# EAGLE design RC TOOLBOX (EAGLE 9.7.0)

## Sheet 1 of 3
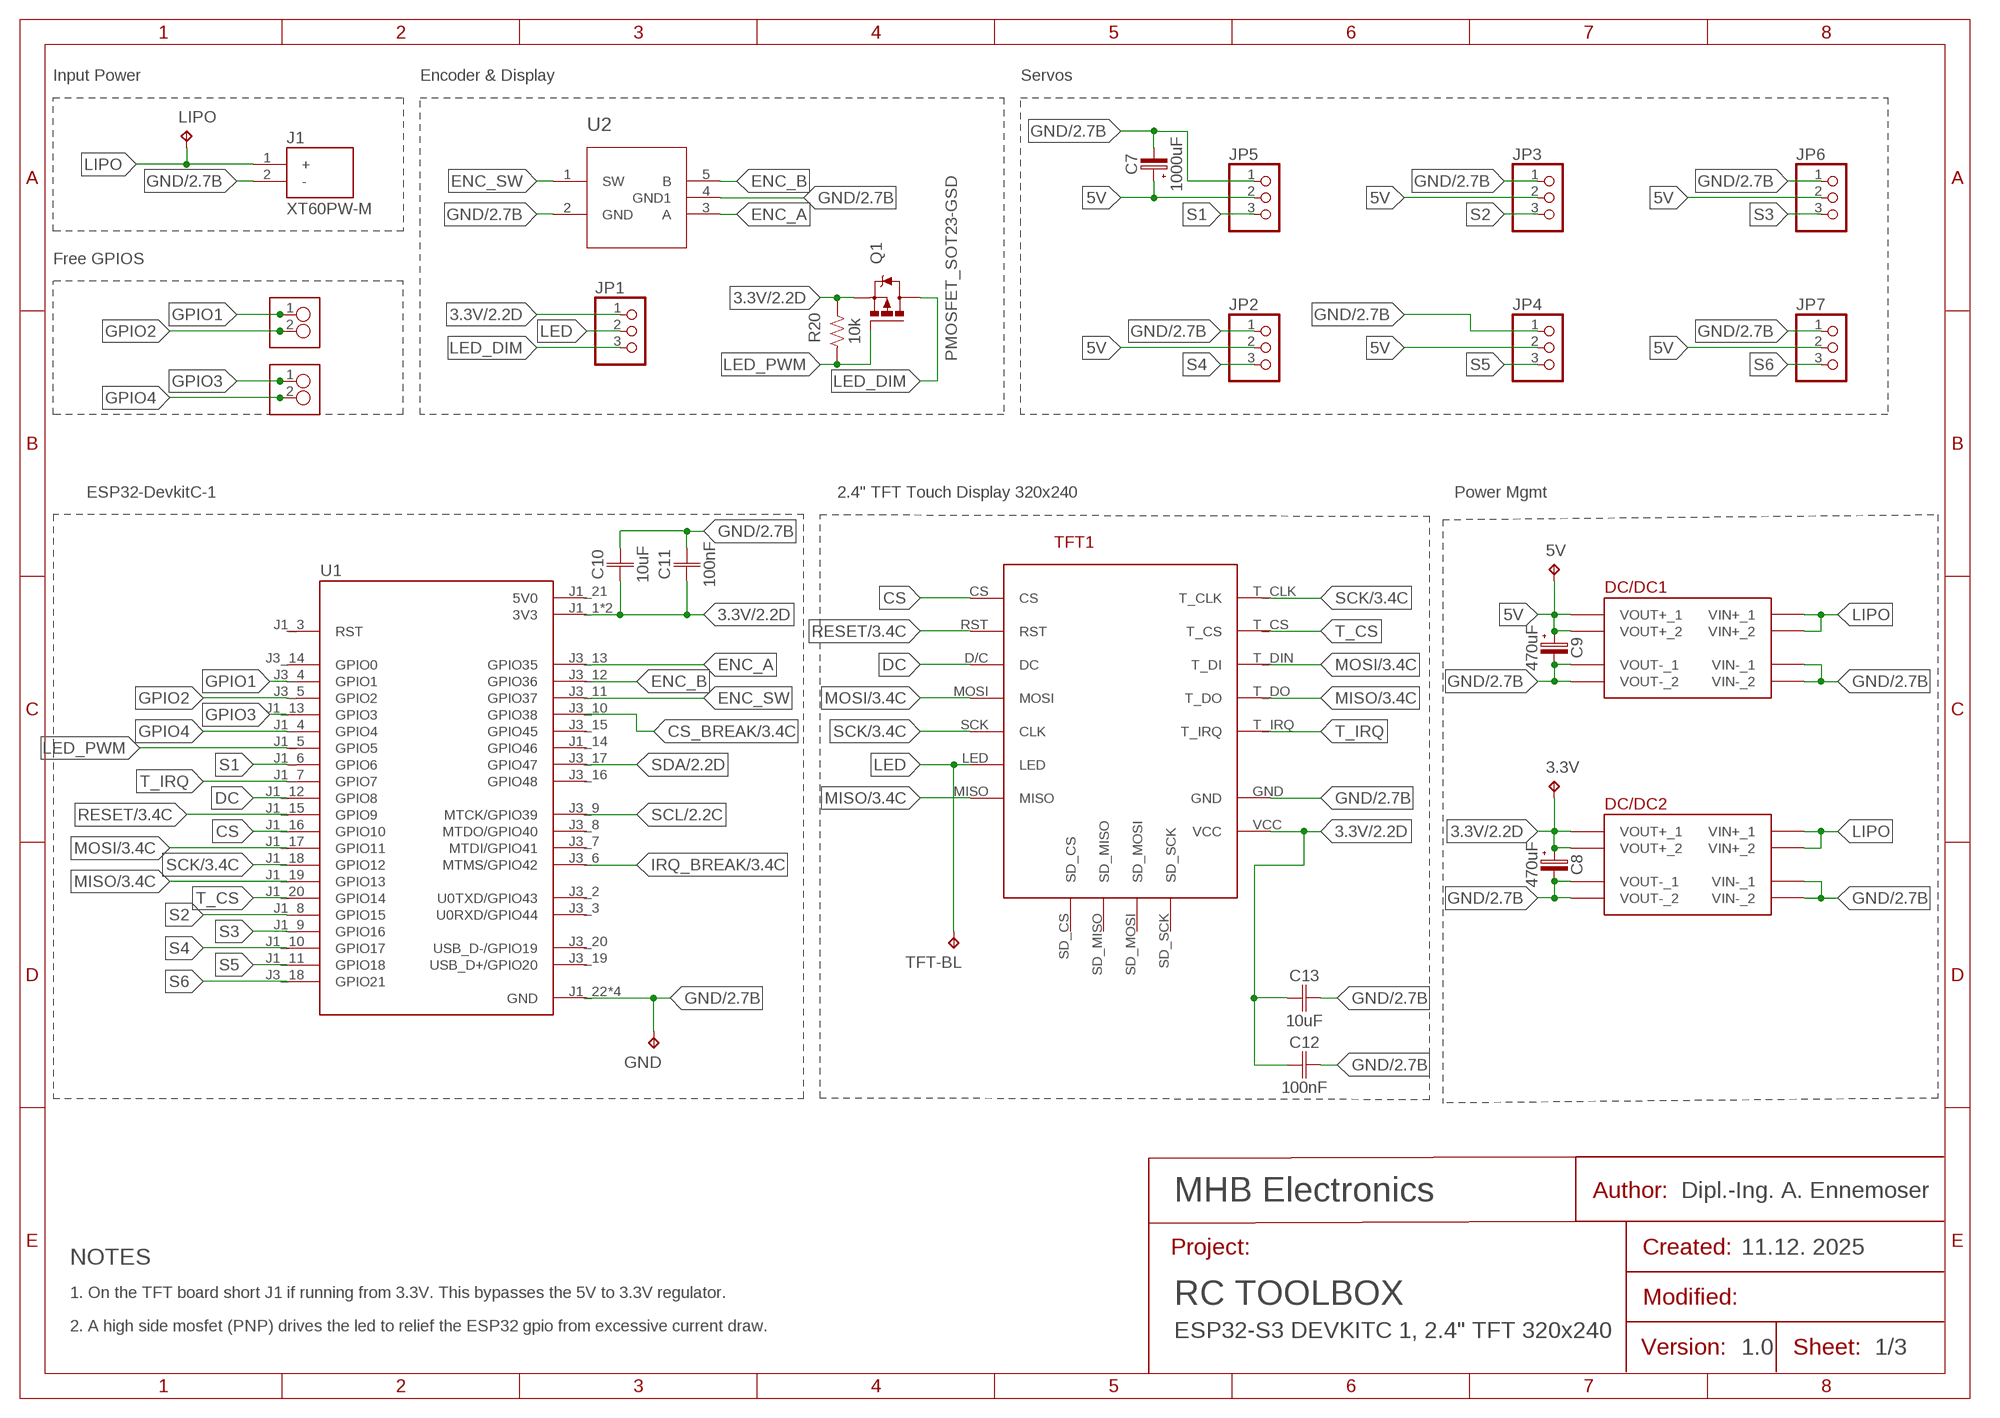
[diagram p0: schematic, sheet 1]
U$1 (FRAME_AE_A4L): AUTHOR1: Dipl.-Ing. A. Ennemoser; COMPANY: MHB Electronics; CREATED: 11.12. 2025; TITLE_1: RC TOOLBOX; TITLE_2: ESP32-S3 DEVKITC 1, 2.4" TFT 320x240; VERSION: 1.0

### Parts
3.3V  TPB1,27  [B1,27]
5V  TPB1,27  [B1,27]
C7  1000uF  C-POL_ECAP-8.5MM  [CAPAE830X1050N]
C8  470uF  C-POL_ECAP-8.5MM  [CAPAE830X1050N]
C9  470uF  C-POL_ECAP-8.5MM  [CAPAE830X1050N]
C10  10uF  C_CHIP-1206(3216-METRIC)  [CAPC3216X135]
C11  100nF  C_CHIP-1206(3216-METRIC)  [CAPC3216X135]
C12  100nF  C_CHIP-1206(3216-METRIC)  [CAPC3216X135]
C13  10uF  C_CHIP-1206(3216-METRIC)  [CAPC3216X135]
DC/DC1  DC/DC_4.5-28VIN_0.8-20VOUTDC/DC_4.5-28VIN_0.8-20VOUT  [DC/DC_4.5-28VIN_0.8-20VOUT]
DC/DC2  DC/DC_4.5-28VIN_0.8-20VOUTDC/DC_4.5-28VIN_0.8-20VOUT  [DC/DC_4.5-28VIN_0.8-20VOUT]
GND  TPB1,27  [B1,27]
J1  XT60PW-M  [AMASS_XT60PW-M]
JP1  PINHD-1X3  [1X03]
JP2  PINHD-1X3  [1X03]
JP3  PINHD-1X3  [1X03]
JP4  PINHD-1X3  [1X03]
JP5  PINHD-1X3  [1X03]
JP6  PINHD-1X3  [1X03]
JP7  PINHD-1X3  [1X03]
JP8  PINHD_1X2PINHD_1X2  [PINHD_1X2]
JP10  PINHD_1X2PINHD_1X2  [PINHD_1X2]
LIPO  TPB1,27  [B1,27]
Q1  PMOSFET_SOT23-GSD  [SOT23]
R20  10k  R-US_CHIP-1206(3216-METRIC)  [RESC3216X70]
TFT1  2.4" 320x240 ILI9341/XPT2046 Touch Display  TFT_TOUCH_ILI9341  [TFT_TOUCH_ILI9341_2.4_INCH]
TFT-BL  TPB1,27  [B1,27]
U1  ESP32-S3-DEVKITC-1-N8R2  [XCVR_ESP32-S3-DEVKITC-1-N8R2]
U2  EC11-360EC11-360  [EC11-360]

### Nets
3.3V: 3.3V.TP C8.1(+) C10.1 C11.1 C12.1 C13.1 DC/DC2.VOUT+_1 DC/DC2.VOUT+_2 JP1.1 Q1.2(S) R20.2 TFT1.VCC U1.J1_1(3V3) U1.J1_2(3V3) ; also sheet 2,3
5V: 5V.TP C7.1(+) C9.1(+) DC/DC1.VOUT+_1 DC/DC1.VOUT+_2 JP2.2 JP3.2 JP4.2 JP5.2 JP6.2 JP7.2
CS: TFT1.CS U1.J1_16(GPIO10)
CS_BREAK: U1.J3_10(GPIO38) ; also sheet 3
DC: TFT1.D/C(DC) U1.J1_12(GPIO8)
ENC_A: U1.J3_13(GPIO35) U2.3(A)
ENC_B: U1.J3_12(GPIO36) U2.5(B)
ENC_SW: U1.J3_11(GPIO37) U2.1(SW)
GND: C7.2(-) C8.2(-) C9.2(-) C10.2 C11.2 C12.2 C13.2 DC/DC1.VIN-_1 DC/DC1.VIN-_2 DC/DC1.VOUT-_1 DC/DC1.VOUT-_2 DC/DC2.VIN-_1 DC/DC2.VIN-_2 DC/DC2.VOUT-_1 DC/DC2.VOUT-_2 GND.TP J1.2(-) JP2.1 JP3.1 JP4.1 JP5.1 JP6.1 JP7.1 TFT1.GND U1.J1_22(GND) U1.J3_1(GND) U1.J3_21(GND) U1.J3_22(GND) U2.2(GND) U2.4(GND1) ; also sheet 2,3
GPIO1: JP10.1 U1.J3_4(GPIO1)
GPIO2: JP10.2 U1.J3_5(GPIO2)
GPIO3: JP8.1 U1.J1_13(GPIO3)
GPIO4: JP8.2 U1.J1_4(GPIO4)
IRQ_BREAK: U1.J3_6(MTMS/GPIO42) ; also sheet 3
LED: JP1.2 TFT1.LED TFT-BL.TP
LED_DIM: JP1.3 Q1.3(D)
LED_PWM: Q1.1(G) R20.1 U1.J1_5(GPIO5)
LIPO: DC/DC1.VIN+_1 DC/DC1.VIN+_2 DC/DC2.VIN+_1 DC/DC2.VIN+_2 J1.1(+) LIPO.TP
MISO: TFT1.MISO TFT1.T_DO U1.J1_19(GPIO13) ; also sheet 3
MOSI: TFT1.MOSI TFT1.T_DIN(T_DI) U1.J1_17(GPIO11) ; also sheet 3
RESET: TFT1.RST U1.J1_15(GPIO9) ; also sheet 3
S1: JP5.3 U1.J1_6(GPIO6)
S2: JP3.3 U1.J1_8(GPIO15)
S3: JP6.3 U1.J1_9(GPIO16)
S4: JP2.3 U1.J1_10(GPIO17)
S5: JP4.3 U1.J1_11(GPIO18)
S6: JP7.3 U1.J3_18(GPIO21)
SCK: TFT1.SCK(CLK) TFT1.T_CLK U1.J1_18(GPIO12) ; also sheet 3
SCL: U1.J3_9(MTCK/GPIO39) ; also sheet 2,3
SDA: U1.J3_17(GPIO47) ; also sheet 2,3
T_CS: TFT1.T_CS U1.J1_20(GPIO14)
T_IRQ: TFT1.T_IRQ U1.J1_7(GPIO7)
Unconnected: TFT1.SD_CS TFT1.SD_MISO TFT1.SD_MOSI TFT1.SD_SCK U1.J1_3(RST) U1.J1_14(GPIO46) U1.J3_2(U0TXD/GPIO43) U1.J3_3(U0RXD/GPIO44) U1.J3_7(MTDI/GPIO41) U1.J3_8(MTDO/GPIO40) U1.J3_14(GPIO0) U1.J3_15(GPIO45) U1.J3_16(GPIO48) U1.J3_19(USB_D+/GPIO20) U1.J3_20(USB_D-/GPIO19)

### Notes on the sheet
- Input Power | Encoder & Display | Servos
- Free GPIOS
- ESP32-DevkitC-1 | 2.4" TFT Touch Display 320x240 | Power Mgmt
- NOTES
- 1. On the TFT board short J1 if running from 3.3V. This bypasses the 5V to 3.3V regulator.
- 2. A high side mosfet (PNP) drives the led to relief the ESP32 gpio from excessive current draw.

## Sheet 2 of 3
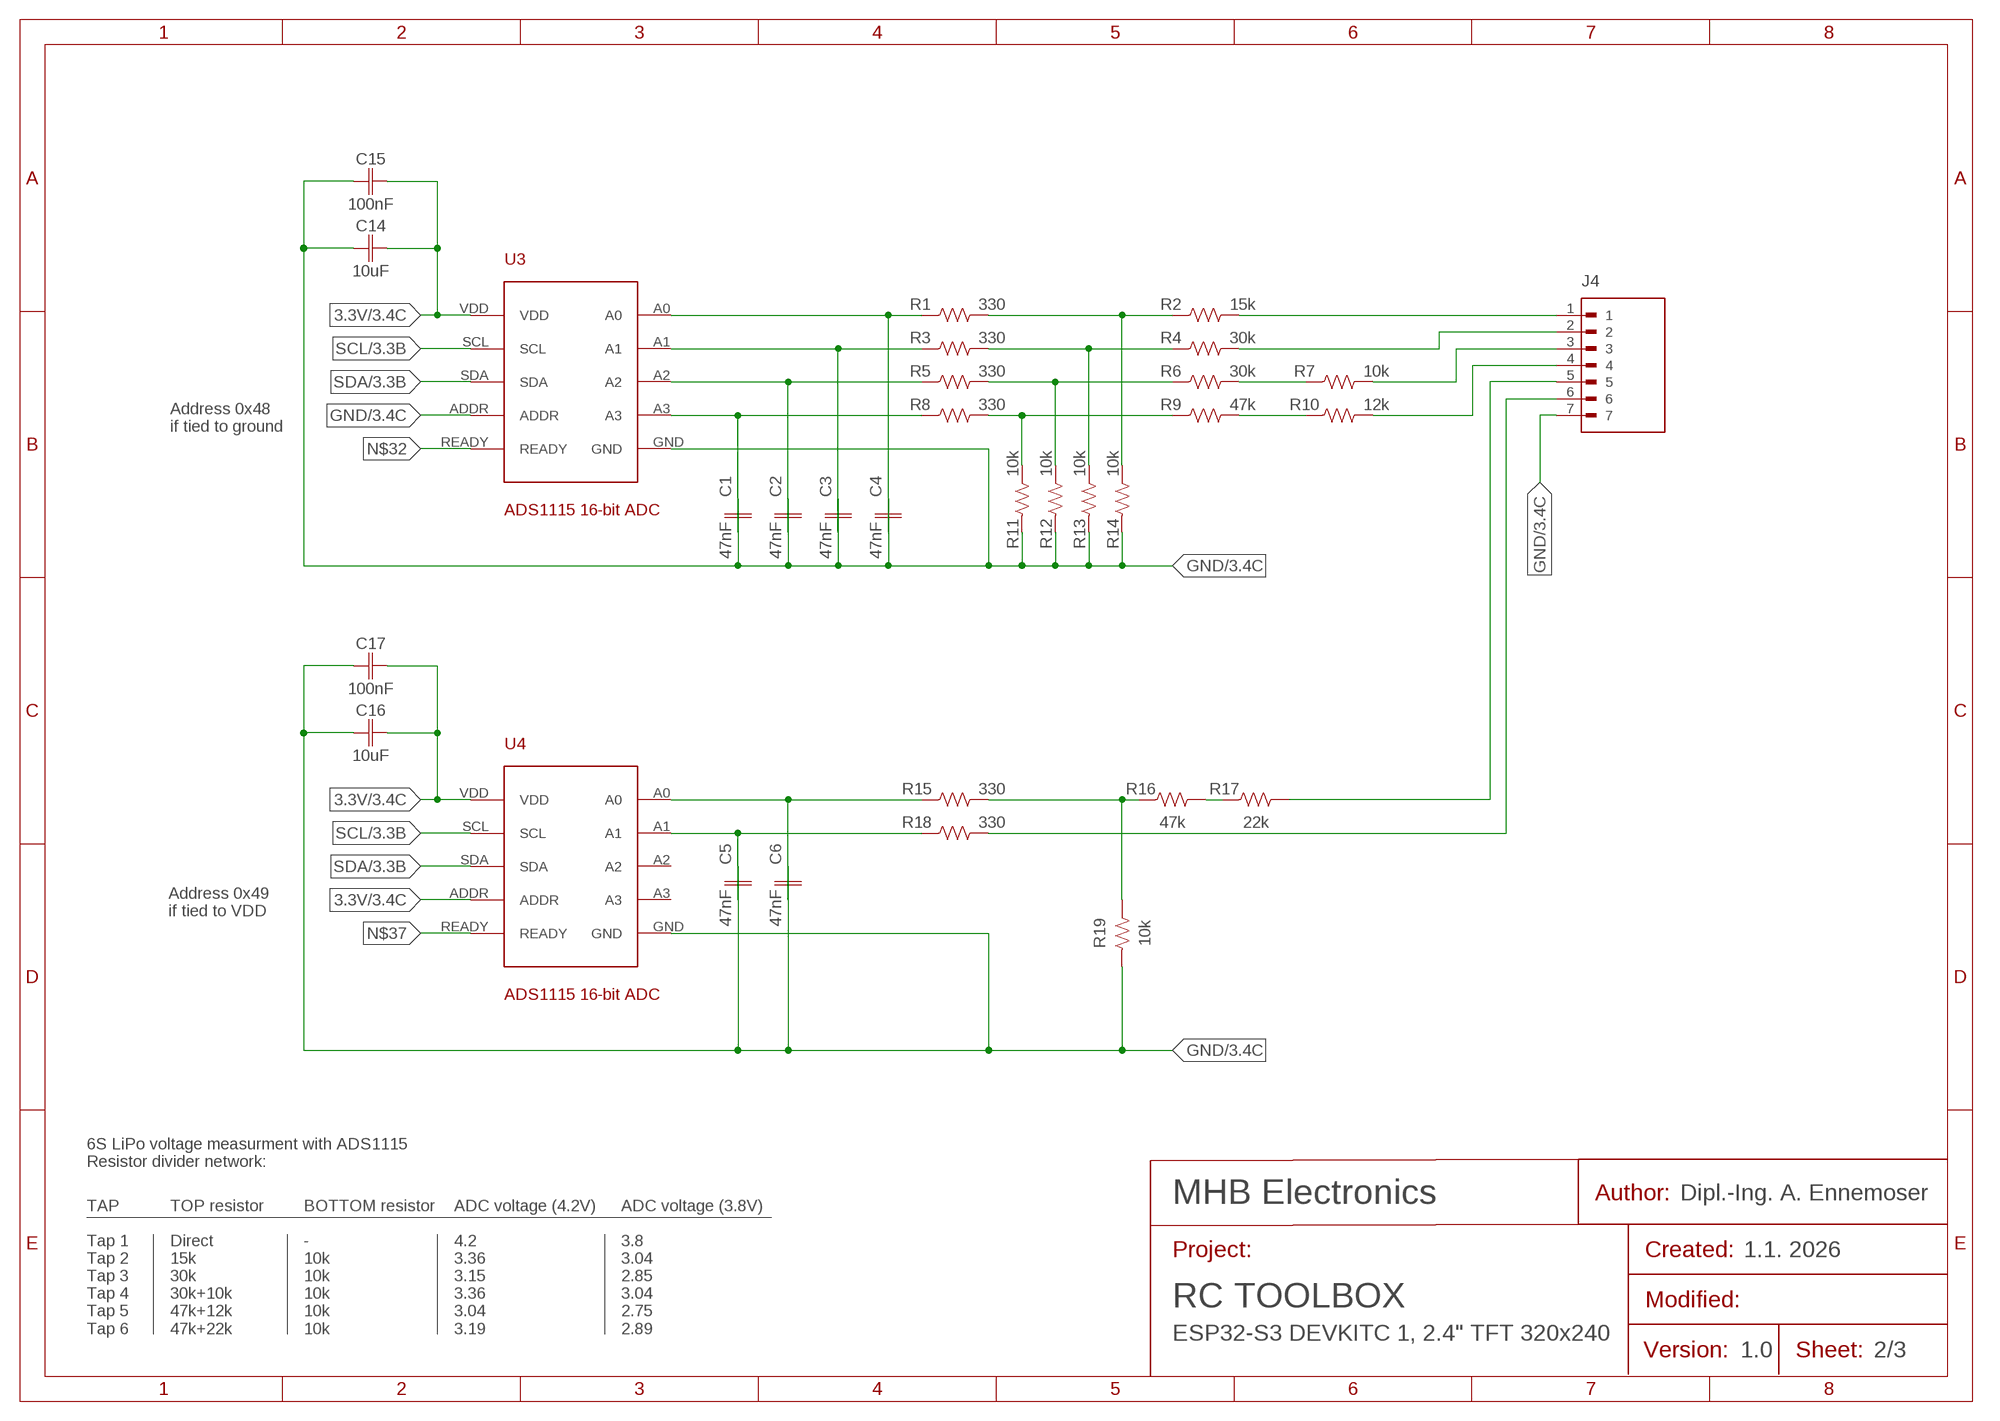
[diagram p1: schematic, sheet 2]
U$2 (FRAME_AE_A4L): AUTHOR1: Dipl.-Ing. A. Ennemoser; COMPANY: MHB Electronics; CREATED: 1.1. 2026; TITLE_1: RC TOOLBOX; TITLE_2: ESP32-S3 DEVKITC 1, 2.4" TFT 320x240; VERSION: 1.0

### Parts
C1  47nF  C_CHIP-1206(3216-METRIC)  [CAPC3216X135]
C2  47nF  C_CHIP-1206(3216-METRIC)  [CAPC3216X135]
C3  47nF  C_CHIP-1206(3216-METRIC)  [CAPC3216X135]
C4  47nF  C_CHIP-1206(3216-METRIC)  [CAPC3216X135]
C5  47nF  C_CHIP-1206(3216-METRIC)  [CAPC3216X135]
C6  47nF  C_CHIP-1206(3216-METRIC)  [CAPC3216X135]
C14  10uF  C_CHIP-1206(3216-METRIC)  [CAPC3216X135]
C15  100nF  C_CHIP-1206(3216-METRIC)  [CAPC3216X135]
C16  10uF  C_CHIP-1206(3216-METRIC)  [CAPC3216X135]
C17  100nF  C_CHIP-1206(3216-METRIC)  [CAPC3216X135]
J4  S7B-XH-AS7B-XH-A  [S7B-XH-A]
R1  330  R-US_CHIP-1206(3216-METRIC)  [RESC3216X70]
R2  15k  R-US_CHIP-1206(3216-METRIC)  [RESC3216X70]
R3  330  R-US_CHIP-1206(3216-METRIC)  [RESC3216X70]
R4  30k  R-US_CHIP-1206(3216-METRIC)  [RESC3216X70]
R5  330  R-US_CHIP-1206(3216-METRIC)  [RESC3216X70]
R6  30k  R-US_CHIP-1206(3216-METRIC)  [RESC3216X70]
R7  10k  R-US_CHIP-1206(3216-METRIC)  [RESC3216X70]
R8  330  R-US_CHIP-1206(3216-METRIC)  [RESC3216X70]
R9  47k  R-US_CHIP-1206(3216-METRIC)  [RESC3216X70]
R10  12k  R-US_CHIP-1206(3216-METRIC)  [RESC3216X70]
R11  10k  R-US_CHIP-1206(3216-METRIC)  [RESC3216X70]
R12  10k  R-US_CHIP-1206(3216-METRIC)  [RESC3216X70]
R13  10k  R-US_CHIP-1206(3216-METRIC)  [RESC3216X70]
R14  10k  R-US_CHIP-1206(3216-METRIC)  [RESC3216X70]
R15  330  R-US_CHIP-1206(3216-METRIC)  [RESC3216X70]
R16  47k  R-US_CHIP-1206(3216-METRIC)  [RESC3216X70]
R17  22k  R-US_CHIP-1206(3216-METRIC)  [RESC3216X70]
R18  330  R-US_CHIP-1206(3216-METRIC)  [RESC3216X70]
R19  10k  R-US_CHIP-1206(3216-METRIC)  [RESC3216X70]
U3  ADS1115 16-bit ADC  ADS1115ADS1115_BREAKOUT  [ADS1115_BREAKOUT]
U4  ADS1115 16-bit ADC  ADS1115ADS1115_BREAKOUT  [ADS1115_BREAKOUT]

### Nets
3.3V: C14.2 C15.2 C16.2 C17.2 U3.VDD U4.ADDR U4.VDD ; also sheet 1,3
GND: C1.2 C2.2 C3.2 C4.2 C5.2 C6.2 C14.1 C15.1 C16.1 C17.1 J4.7 R11.1 R12.1 R13.1 R14.1 R19.1 U3.ADDR U3.GND U4.GND ; also sheet 1,3
N$3: J4.6 R18.2
N$4: R16.2 R17.1
N$5: R6.2 R7.1
N$6: R9.2 R10.1
N$10: C1.1 R8.1 U3.A3
N$11: J4.5 R17.2
N$13: C4.1 R1.1 U3.A0
N$14: R15.2 R16.1 R19.2
N$15: R1.2 R2.1 R14.2
N$17: C3.1 R3.1 U3.A1
N$18: C2.1 R5.1 U3.A2
N$19: C5.1 R18.1 U4.A1
N$20: C6.1 R15.1 U4.A0
N$22: R8.2 R9.1 R11.2
N$23: J4.1 R2.2
N$24: R3.2 R4.1 R13.2
N$25: R5.2 R6.1 R12.2
N$26: J4.3 R7.2
N$27: J4.4 R10.2
N$30: J4.2 R4.2
N$32: U3.READY
N$37: U4.READY
SCL: U3.SCL U4.SCL ; also sheet 1,3
SDA: U3.SDA U4.SDA ; also sheet 1,3
Unconnected: U4.A2 U4.A3

### Notes on the sheet
- Address 0x48
  if tied to ground
- Address 0x49
  if tied to VDD
- 6S LiPo voltage measurment with ADS1115
  Resistor divider network:
- TAP
  
  Tap 1
  Tap 2
  Tap 3
  Tap 4
  Tap 5
  Tap 6
- TOP resistor
  
  Direct
  15k
  30k
  30k+10k
  47k+12k
  47k+22k
- BOTTOM resistor
  
  -
  10k
  10k
  10k
  10k
  10k
- ADC voltage (4.2V)
  
  4.2
  3.36
  3.15
  3.36
  3.04
  3.19
- ADC voltage (3.8V)
  
  3.8
  3.04
  2.85
  3.04
  2.75
  2.89

## Sheet 3 of 3
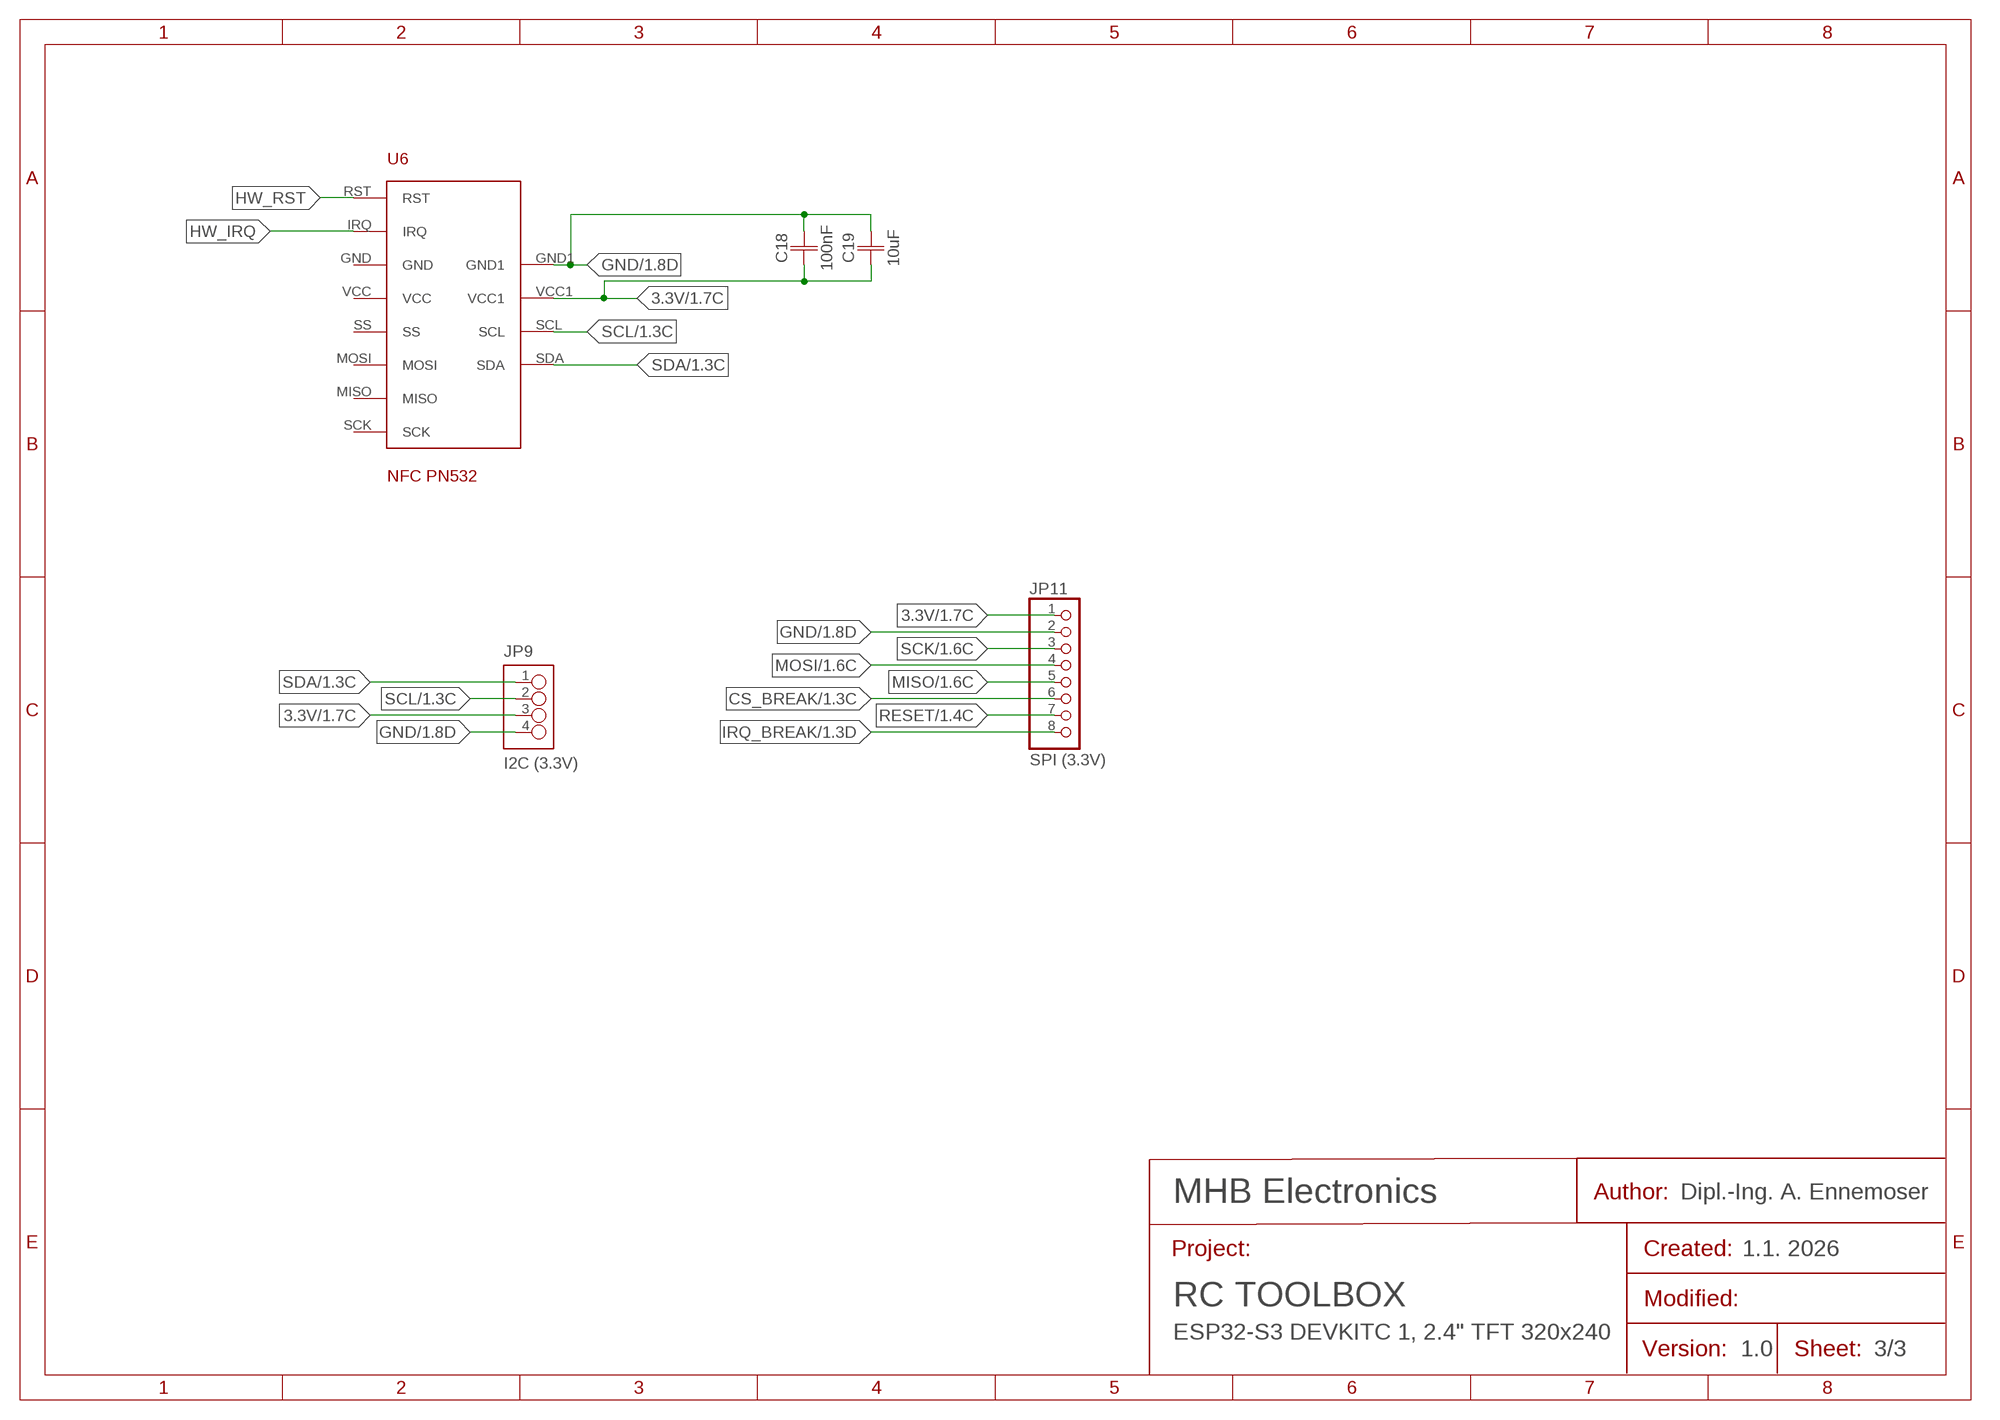
[diagram p2: schematic, sheet 3]
U$5 (FRAME_AE_A4L): AUTHOR1: Dipl.-Ing. A. Ennemoser; COMPANY: MHB Electronics; CREATED: 1.1. 2026; TITLE_1: RC TOOLBOX; TITLE_2: ESP32-S3 DEVKITC 1, 2.4" TFT 320x240; VERSION: 1.0

### Parts
C18  100nF  C_CHIP-1206(3216-METRIC)  [CAPC3216X135]
C19  10uF  C_CHIP-1206(3216-METRIC)  [CAPC3216X135]
JP9  I2C (3.3V)  PINHD_1X4PINHD_1X4  [PINHD_1X4]
JP11  SPI (3.3V)  PINHD-1X8CLEANBIG  [1X08-CLEANBIG]
U6  NFC PN532  NFC-PN532HW-147C-PN532  [NFC-PN532]

### Nets
3.3V: C18.1 C19.1 JP9.3 JP11.1 U6.VCC1 ; also sheet 1,2
CS_BREAK: JP11.6 ; also sheet 1
GND: C18.2 C19.2 JP9.4 JP11.2 U6.GND1 ; also sheet 1,2
HW_IRQ: U6.IRQ
HW_RST: U6.RST
IRQ_BREAK: JP11.8 ; also sheet 1
MISO: JP11.5 ; also sheet 1
MOSI: JP11.4 ; also sheet 1
RESET: JP11.7 ; also sheet 1
SCK: JP11.3 ; also sheet 1
SCL: JP9.2 U6.SCL ; also sheet 1,2
SDA: JP9.1 U6.SDA ; also sheet 1,2
Unconnected: U6.GND U6.MISO U6.MOSI U6.SCK U6.SS U6.VCC

## Power pins joined to a net without a drawn wire
5V0: U1.J1_21(5V0)

## Library data of the parts
3.3V 5V GND LIPO TFT-BL = testpad:TP: Test pad
C1-C6 C10-C19 = Capacitor:C: Capacitor - Generic; CATEGORY: Capacitor; PACKAGE_SIZE: 1206; PACKAGE_TYPE: Surface Mount; SUBCATEGORY: Ceramic Capacitors; TYPE: MLCC
C7-C9 = Capacitor:C-POL: Capacitor Polarised - Generic; CATEGORY: Capacitor; PACKAGE_SIZE: 8.5MM; PACKAGE_TYPE: Surface Mount; SUBCATEGORY: Aluminum Electrolytic Capacitors; TYPE: Radial Can
DC/DC1 DC/DC2 = Bibliothek:DC/DC_4.5-28VIN_0.8-20VOUT
J1 = AE_EAGLE_LIBRARY_FUSION:XT60PW-M: XT60PW-M AMASS PCB mountable XT60 connector; AVAILABILITY: Not in stock; CHECK_PRICES: https://www.snapeda.com/parts/XT60PW-M/AMASS/view-part/?ref=eda; DESCRIPTION: Socket, DC supply, male, PIN: 2; MF: AMASS; MP: XT60PW-M; PACKAGE: Package; PRICE: None; SNAPEDA_LINK: https://www.snapeda.com/parts/XT60PW-M/AMASS/view-part/?ref=snap
J4 = JST_SxB-XH-A:S7B-XH-A: Check availability <https://pricing.snapeda.com/parts/S9B-XH-A%28LF%29%28SN%29/JST%20Sales%20America%20Inc./view-part?ref=eda>
JP1-JP7 = adafruit:PINHD-1X3: PIN HEADER
JP8 JP10 = PINHD_AE:PINHD_1X2
JP9 = PINHD_AE:PINHD_1X4
JP11 = adafruit:PINHD-1X8: PIN HEADER
Q1 = Transistor:PMOSFET: P-Channel MOSFET - Generic; CATEGORY: Transistor; DATASHEET: https://www.analog.com/media/en/package-pcb-resources/package/pkg_pdf/ltc-legacy-sot-23/sot3%2005-08-1631%20rev%20d.pdf; DESCRIPTION: Generic P-Channel MOSFET Surface Mount SOT23 Package; PACKAGE_SIZE: SOT23; PACKAGE_TYPE: Surface Mount; SUBCATEGORY: MOSFET; TYPE: P-Channel
R1-R20 = Resistor:R-US: Resistor Fixed - ANSI; CATEGORY: Resistors; DESCRIPTION: Chip Resistor 3.20 X 1.60 X 0.70 mm body 1206(3216-METRIC) Package; PACKAGE_SIZE: 1206; PACKAGE_TYPE: Surface Mount
TFT1 = WIRELESS CNC CONTROLLER LIBRARY:TFT_TOUCH_ILI9341: TFT touch displays using the ILI9341 SPI driver and XPT2046 touch driver
U1 = ESP32-S3-DEVKITC-1-N8R2:ESP32-S3-DEVKITC-1-N8R2; MANUFACTURER: Espressif; PARTREV: V1; STANDARD: Manufacturer Recommendations
U2 = EC11-360:EC11-360; COPYRIGHT: Copyright (C) 2025 Ultra Librarian. All rights reserved.; MANUFACTURER_NAME: TT Electronics; MANUFACTURER_PART_NUMBER: EN11-HSM1AQ15
U3 U4 = ADS1115_16bit_ADC:ADS1115
U6 = NFC-PN532:NFC-PN532

## Board
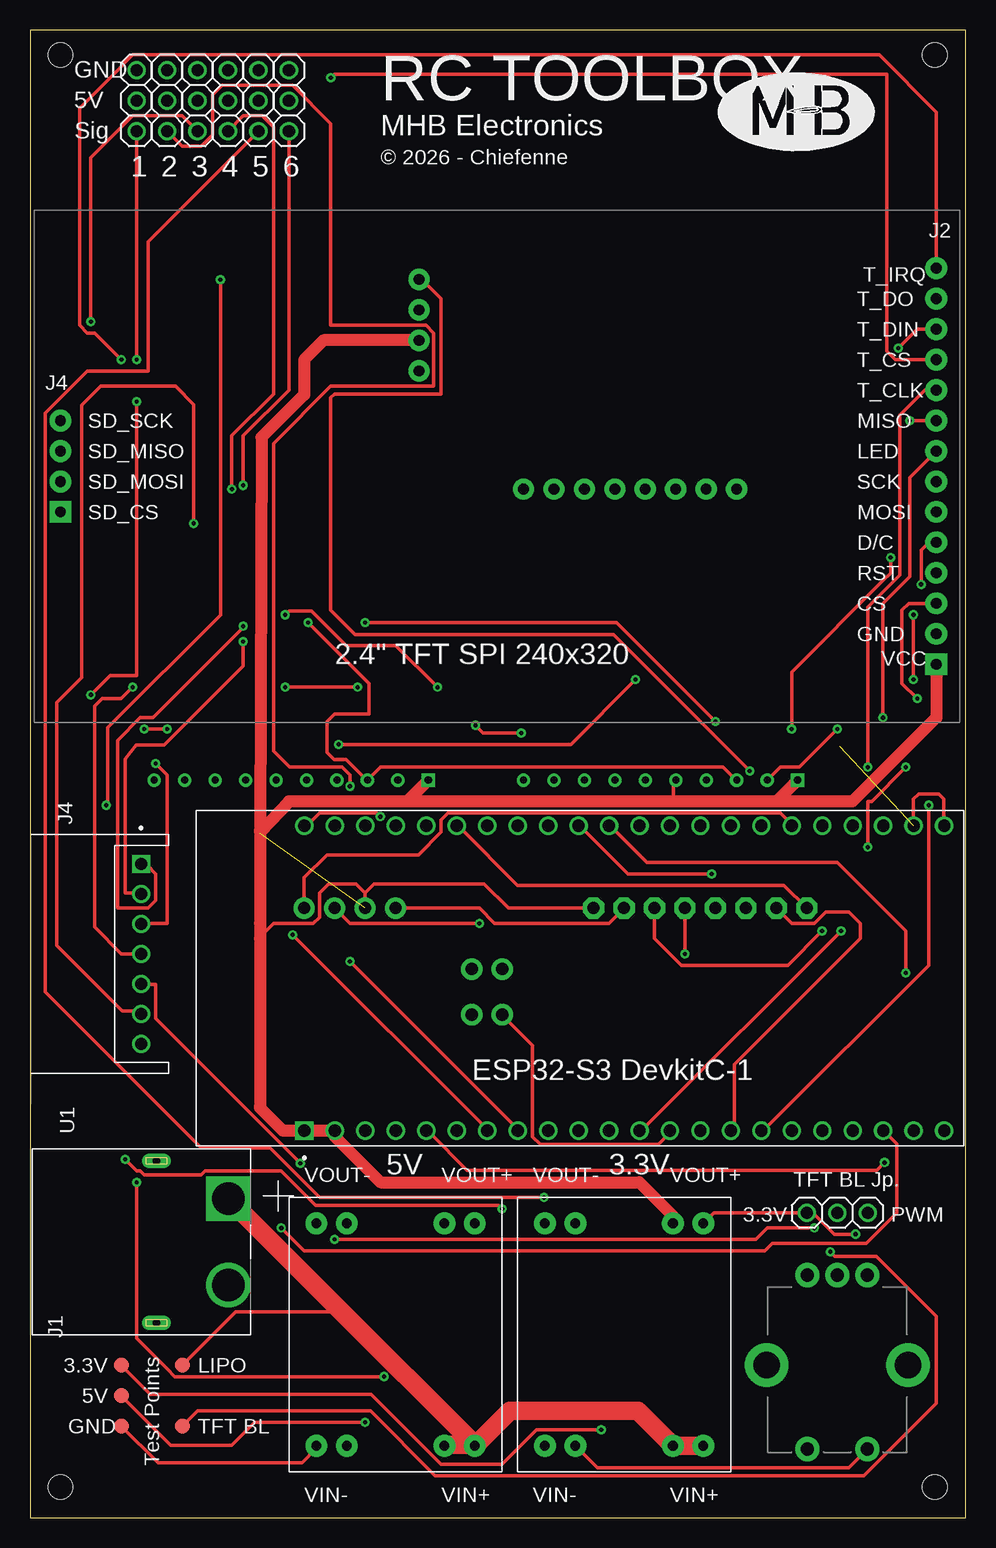
[diagram p3: board, top side]
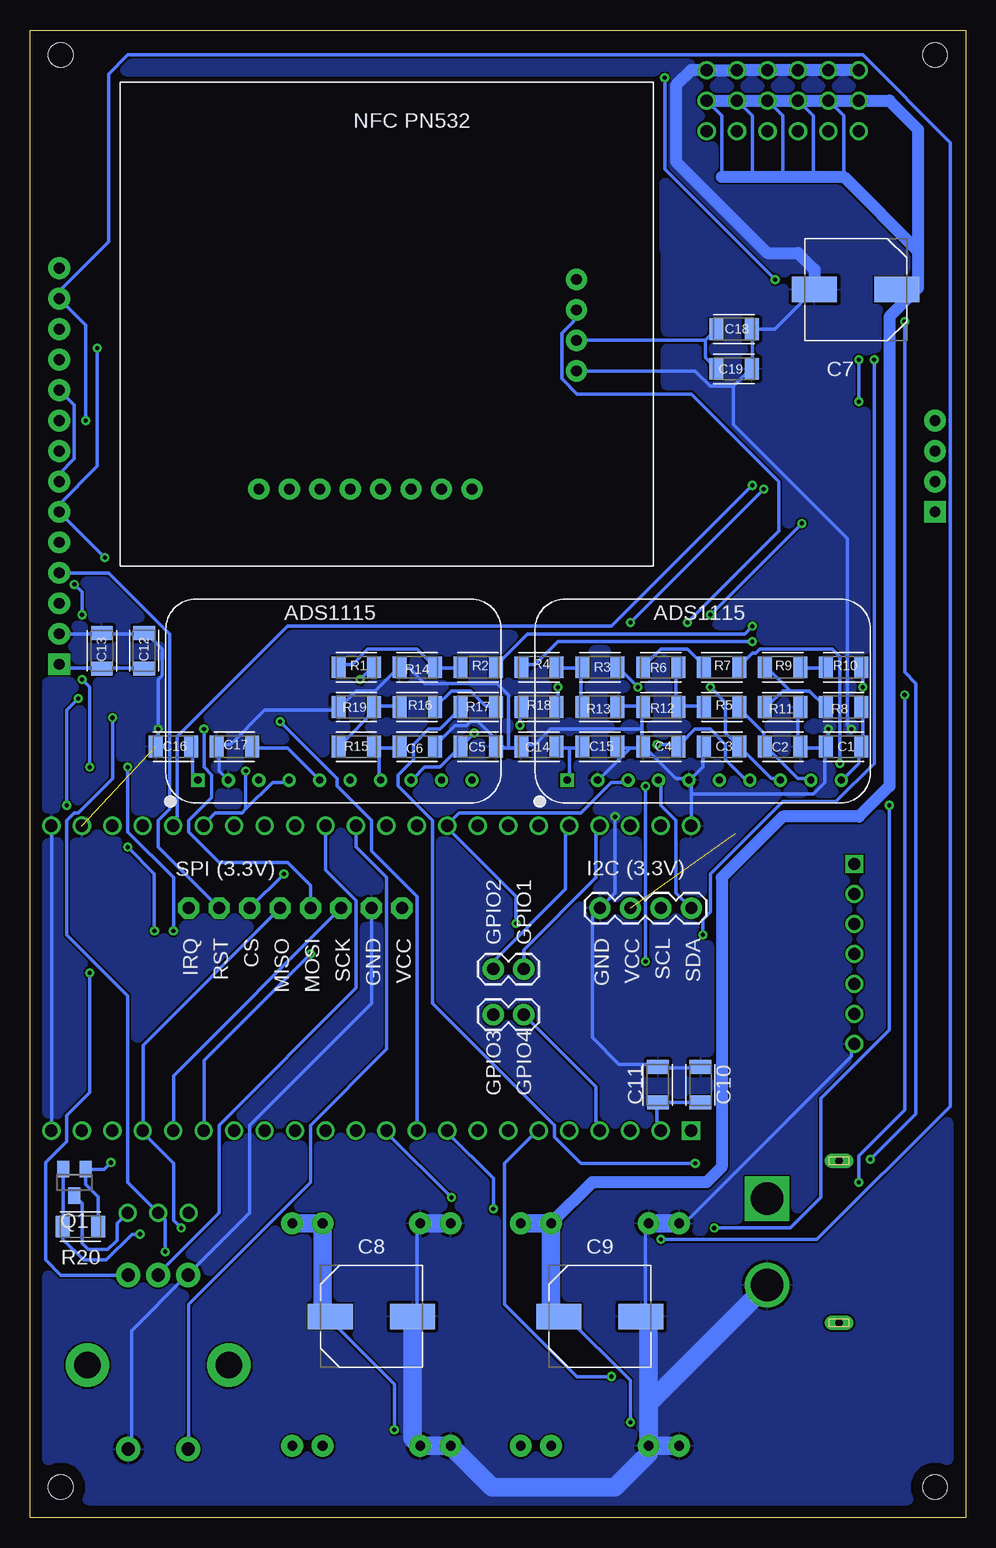
[diagram p4: board, bottom side, seen from below]

Size 78 x 124 mm. Coordinates in mm from the lower left corner, seen from the top.
Outline: 0,0 78,0 78,124 0,124 0,0
Copper layers (1*16): Top / Bottom
Stack-up Default Layer Stack: Top SilkScreen Epoxy Ink / Top SolderMask SR:Green 0.0254mm Dk 4.3 / Top Surface Finish Lead-Free 0.02mm / Top CuFoil:007 0.035mm / Dielectric-1 User Defined 1.5mm / Bottom CuFoil:007 0.035mm / Bottom Surface Finish Lead-Free 0.02mm / Bottom SolderMask SR:Green 0.0254mm Dk 4.3 / Bottom SilkScreen Epoxy Ink
Design rules: minimum drill size 0.35mm, minimum copper width signal=LIPO 35mil, minimum copper width signal=5V 25mil, minimum copper width 12mil, keepout clearance 0mil, drill distance 6mil, via restrict clearance 0mil, dimension clearance 40mil, restrict clearance 0mil, copper clearance wire_polygon to wire_polygon 6mil, copper clearance wire_polygon to pad_smd 6mil, copper clearance wire_polygon to via 6mil, copper clearance pad_smd to pad_smd 6mil, copper clearance pad_smd to via 6mil, copper clearance via to via 6mil, copper clearance smd to pad (same net) 6mil, copper clearance smd to via (same net) 6mil, copper clearance smd to smd (same net) 6mil
Holes 2.03 mm at 75.44,121.92 75.44,2.54 2.54,2.54 2.54,121.92
RestrictTop: area 25.5,78.9 to 71.1,120.1
RestrictBottom: area 25.5,78.9 to 71.1,120.1

### Footprints (pad centres in the part's own frame; a part is rotated, then mirrored left to right if it is on the bottom)
B1,27 = smd 1.27 x 1.27: TP 0,0
CAPC3216X135 = smd 1.165 x 1.815: 1 -1.475,0; 2 1.475,0
CAPAE830X1050N = smd 3.764 x 2.115: 1 -3.426,0; 2 3.426,0
DC/DC_4.5-28VIN_0.8-20VOUT = drill 0.813 pad 1.829: VIN+_1 9.271,6.604; VIN+_2 9.271,4.064; VIN-_1 9.271,-4.064; VIN-_2 9.271,-6.604; VOUT+_1 -9.271,6.604; VOUT+_2 -9.271,4.064; VOUT-_1 -9.271,-4.064; VOUT-_2 -9.271,-6.604
AMASS_XT60PW-M = drill 2.7 square: 1 3.6,-6 | drill 2.7: 2 -3.6,-6 | drill 0.6 pad 1.2 long: S1 6.75,0; S2 -6.75,0
S7B-XH-A = drill 1 square: 1 -7.5,4.43 | drill 1: 2 -5,4.43; 3 -2.5,4.43; 4 0,4.43; 5 2.5,4.43; 6 5,4.43; 7 7.5,4.43
1X03 = drill 1.016: 1 -2.54,0; 2 0,0; 3 2.54,0
PINHD_1X2 = drill 1.016 pad 1.778: 1 -1.27,0; 2 1.27,0
PINHD_1X4 = drill 1.016 pad 1.778: 1 -3.81,0; 2 -1.27,0; 3 1.27,0; 4 3.81,0
1X08-CLEANBIG = drill 1.016 pad 1.778 octagon: 1 -8.89,0; 2 -6.35,0; 3 -3.81,0; 4 -1.27,0; 5 1.27,0; 6 3.81,0; 7 6.35,0; 8 8.89,0
SOT23 = smd 1 x 1.4: 1 -0.95,-1.1; 2 0.95,-1.1; 3 0,1.1
RESC3216X70 = smd 1.165 x 1.815: 1 -1.475,0; 2 1.475,0
TFT_TOUCH_ILI9341_2.4_INCH = drill 0.889 pad 1.803: CS 37.465,-11.43; D/C 37.465,-6.35; GND 37.465,-13.97; LED 37.465,1.27; MISO 37.465,3.81; MOSI 37.465,-3.81; RST 37.465,-8.89; SCK 37.465,-1.27; SD_MISO -35.56,1.27; SD_MOSI -35.56,-1.27; SD_SCK -35.56,3.81; T_CLK 37.465,6.35; T_CS 37.465,8.89; T_DIN 37.465,11.43; T_DO 37.465,13.97; T_IRQ 37.465,16.51 | drill 0.889 pad 1.803 square: SD_CS -35.56,-3.81; VCC 37.465,-16.51
XCVR_ESP32-S3-DEVKITC-1-N8R2 = drill 1.02 square: J1_1 -12.7,29.97 | drill 1.02: J1_2 -12.7,27.43; J1_3 -12.7,24.89; J1_4 -12.7,22.35; J1_5 -12.7,19.81; J1_6 -12.7,17.27; J1_7 -12.7,14.73; J1_8 -12.7,12.19; J1_9 -12.7,9.65; J1_10 -12.7,7.11; J1_11 -12.7,4.57; J1_12 -12.7,2.03; J1_13 -12.7,-0.51; J1_14 -12.7,-3.05; J1_15 -12.7,-5.59; J1_16 -12.7,-8.13; J1_17 -12.7,-10.67; J1_18 -12.7,-13.21; J1_19 -12.7,-15.75; J1_20 -12.7,-18.29; J1_21 -12.7,-20.83; J1_22 -12.7,-23.37; J3_1 12.7,29.97; J3_2 12.7,27.43; J3_3 12.7,24.89; J3_4 12.7,22.35; J3_5 12.7,19.81; J3_6 12.7,17.27; J3_7 12.7,14.73; J3_8 12.7,12.19; J3_9 12.7,9.65; J3_10 12.7,7.11; J3_11 12.7,4.57; J3_12 12.7,2.03; J3_13 12.7,-0.51; J3_14 12.7,-3.05; J3_15 12.7,-5.59; J3_16 12.7,-8.13; J3_17 12.7,-10.67; J3_18 12.7,-13.21; J3_19 12.7,-15.75; J3_20 12.7,-18.29; J3_21 12.7,-20.83; J3_22 12.7,-23.37
EC11-360 = drill 1.118 pad 2.032: 1 -2.5,-7.5; 2 2.5,-7.5; 3 0,-7.5; 4 -2.5,7; 5 2.5,7 | drill 2.2 pad 3.607: P$1 -5.9,0; P$2 5.9,0
ADS1115_BREAKOUT = drill 0.6: A0 -5.08,-3.81; A1 -5.08,-6.35; A2 -5.08,-8.89; A3 -5.08,-11.43; ADDR -5.08,1.27; GND -5.08,8.89; READY -5.08,-1.27; SCL -5.08,6.35; SDA -5.08,3.81 | drill 0.6 square: VDD -5.08,11.43
NFC-PN532 = drill 0.889 pad 1.778: GND 6.347,13.961; GND1 -15.063,4.098; IRQ 8.887,13.961; MISO -3.813,13.961; MOSI -1.273,13.961; RST 11.427,13.961; SCK -6.353,13.961; SCL -15.063,-0.982; SDA -15.063,-3.522; SS 1.267,13.961; VCC 3.807,13.961; VCC1 -15.063,1.558

### Placement (x,y rotation side)
3.3V  7.62,12.7 270 top
5V  7.62,10.16 270 top
C1  10.16,64.26 180 bottom
C2  15.24,64.26 0 bottom
C3  20.32,64.26 180 bottom
C4  25.4,64.26 180 bottom
C5  40.64,64.26 0 bottom
C6  45.72,64.26 0 bottom
C7  9.17,102.36 180 bottom
C8  49.53,16.76 0 bottom
C9  30.48,16.76 0 bottom
C10  22.1,36.07 90 bottom
C11  25.65,36.07 90 bottom
C12  68.48,72.26 90 bottom
C13  72.01,72.24 90 bottom
C14  35.56,64.26 0 bottom
C15  30.48,64.26 180 bottom
C16  66.04,64.26 0 bottom
C17  60.96,64.26 0 bottom
C18  19.3,99.06 0 bottom
C19  19.3,95.76 0 bottom
DC/DC1  30.48,15.24 270 top
DC/DC2  49.53,15.24 270 top
GND  7.62,7.62 270 top
J1  10.54,22.99 90 top
J4  4.83,46.99 270 top
JP1  67.31,25.4 0 top
JP2  16.51,118.11 270 top
JP3  11.43,118.11 270 top
JP4  19.05,118.11 270 top
JP5  8.89,118.11 270 top
JP6  13.97,118.11 270 top
JP7  21.59,118.11 270 top
JP8  38.1,41.91 0 bottom
JP9  26.67,50.8 180 bottom
JP10  38.1,45.72 180 bottom
JP11  55.88,50.8 180 bottom
LIPO  12.7,12.7 270 top
Q1  74.3,27.94 180 bottom
R1  50.8,70.87 180 bottom
R2  40.64,70.87 0 bottom
R3  30.48,70.87 180 bottom
R4  35.56,70.87 180 bottom
R5  20.32,67.56 180 bottom
R6  25.4,70.87 180 bottom
R7  20.32,70.87 0 bottom
R8  10.16,67.56 180 bottom
R9  15.24,70.87 0 bottom
R10  10.16,70.87 0 bottom
R11  15.24,67.56 180 bottom
R12  25.4,67.56 0 bottom
R13  30.48,67.56 180 bottom
R14  45.72,70.87 0 bottom
R15  50.8,64.26 180 bottom
R16  45.72,67.56 0 bottom
R17  40.64,67.56 180 bottom
R18  35.56,67.56 0 bottom
R19  50.8,67.56 0 bottom
R20  73.79,24.26 180 bottom
TFT1  38.1,87.63 0 top
TFT-BL  12.7,7.62 270 top
U1  52.85,44.96 90 top
U2  67.31,12.7 180 top
U3  21.78,66.55 90 bottom
U4  52.58,66.55 90 bottom
U6  47.5,99.69 180 bottom

### Tracks (layer width: path | path; a pad name or v marks a point on that pad's centre or on a via)
3.3V  (via drill 0.35)  (1 unrouted)
  Top 0.305: 53.66,59.69 53.66,61.28 U4.ADDR | DC/DC2.VOUT+_1 57.02,25.4 JP1.1 65.28,25.4 67.06,23.62 v68.83,23.62 | v47.62,7.3 42.23,7.3 39.37,4.45 34.29,4.45 28.45,10.29 10.03,10.29 3.3V.TP | JP9.3 27.94,52.07 | 27.94,52.07 28.7,52.83 37.85,52.83 39.88,50.8 JP11.1 | 27.94,52.07 27.18,52.83 24.89,52.83 24.13,52.07 24.13,50.04 23.62,49.53 20.32,49.53 19.18,48.39 19.18,48.26 | 19.18,57.28 19.18,57.02
  Top 1.016: DC/DC2.VOUT+_2 53.59,25.15 50.8,27.94 29.21,27.94 25.42,31.73 U1.J1_2 U1.J1_1 21.08,32.26 19.18,34.16 19.18,34.29 19.18,48.26 19.18,49.53 19.18,57.15 21.59,59.69 31.44,59.69 | U3.VDD 31.44,59.69 | U4.VDD 62.23,59.69 | 62.23,59.69 53.66,59.69 31.44,59.69 | 19.18,57.28 19.3,90.04 22.86,93.6 22.86,93.98 22.86,96.52 24.48,98.14 U6.VCC1 | TFT1.VCC 75.56,66.67 68.58,59.69 62.23,59.69
  Bottom 0.305: U6.VCC1 21.7,98.14 | 21.7,98.14 C18.1 | C19.1 21.7,96.68 21.7,98.14 | C10.1 22.23,34.61 25.4,34.61 C11.1 25.72,34.29 25.72,32.38 U1.J1_2 | C12.1 68.58,70.8 71.75,70.8 C13.1 72.07,70.8 75.25,70.8 TFT1.VCC | 33.02,64.14 33.97,64.14 C14.2 | 33.02,64.14 32.07,64.14 C15.2 | U4.VDD 64.45,61.91 64.45,64.14 C16.2 | U4.ADDR 56.52,64.14 59.37,64.14 C17.2 | 33.02,64.14 33.02,61.59 U3.VDD | v47.62,7.3 47.62,11.11 52.7,16.19 C8.1 | Q1.2 75.25,24.27 R20.2 75.26,23.19 73.53,21.46 71.63,21.46 69.47,23.62 v68.83,23.62
  Bottom 1.524: DC/DC2.VOUT+_1 DC/DC2.VOUT+_2 53.59,17.4 C8.1
5V  (via drill 0.35)
  Top 0.305: 5V.TP 11.75,6.03 16.83,6.03 18.73,7.94 v27.94,7.94
  Bottom 0.305: JP3.2 10.16,116.84 10.16,111.76 | 3.96,105.56 3.96,105.41 | JP6.2 12.7,116.84 12.7,111.76 | JP2.2 15.24,116.84 15.24,111.76 | JP4.2 17.78,116.84 17.78,111.76 | JP7.2 20.32,116.84 20.32,111.76 | v27.94,7.94 27.94,11.43 33.34,16.83 C9.1
  Bottom 1.016: JP7.2 JP4.2 JP2.2 JP6.2 JP3.2 JP5.2 6.35,118.11 3.96,115.72 3.96,105.41 3.96,102.49 4.96,101.48 | 3.96,105.56 10.16,111.76 12.7,111.76 15.24,111.76 17.78,111.76 20.32,111.76 | 4.96,101.48 6.35,100.1 6.35,60.96 8.89,58.42 15.24,58.42 20.32,53.34 20.32,29.21 21.59,27.94 31.11,27.94 DC/DC1.VOUT+_2 | C7.1 4.96,101.59 4.96,101.48
  Bottom 1.524: DC/DC1.VOUT+_1 DC/DC1.VOUT+_2 34.54,17.4 C9.1
CS  (via drill 0.35)
  Top 0.305: v74.93,59.37 74.93,46.04 61.28,32.38 U1.J1_16 | v73.98,68.26 72.71,69.53 72.71,75.63 73.28,76.2 TFT1.CS
  Bottom 0.305: v74.93,59.37 74.93,67.31 v73.98,68.26
CS_BREAK  (via drill 0.35)
  Top 0.305: v56.83,53.66 49.85,53.66 46.04,57.47 U1.J3_10
  Bottom 0.305: JP11.6 v56.83,53.66
DC  (via drill 0.35)
  Top 0.305: v67.63,48.9 51.12,32.38 U1.J1_12 | v69.85,55.88 69.85,59.69 70.17,59.69 v73.03,62.55 | v73.66,75.25 v73.66,69.85 | TFT1.D/C 74.93,81.28 74.3,80.64 v74.3,77.79
  Bottom 0.305: v67.63,48.9 67.63,53.66 v69.85,55.88 | v73.03,62.55 73.03,69.22 v73.66,69.85 | v73.66,75.25 73.66,77.15 v74.3,77.79
ENC_A
  Bottom 0.305: U1.J3_13 53.34,57.47 53.34,53.98 50.8,51.44 50.8,44.13 62.23,32.7 62.23,25.4 67.31,20.32 U2.3
ENC_B
  Bottom 0.305: U1.J3_12 50.8,57.47 50.8,55.88 48.26,53.34 48.26,39.05 54.61,32.7 54.61,27.94 64.77,17.78 64.77,5.71 U2.5
ENC_SW  (via drill 0.35)
  Top 0.305: v73.03,45.4 73.03,48.9 67.31,54.61 51.44,54.61 48.58,57.47 U1.J3_11
  Bottom 0.305: U2.1 75.44,20.19 76.71,21.46 76.71,29.59 74.93,31.37 74.93,33.53 73.03,35.43 v73.03,45.4
GND  (via drill 0.35)  (1 unrouted)
  Top 0.305: v67.31,65.72 64.14,62.55 62.55,62.55 U4.GND | v11.43,65.72 v9.53,65.72 | DC/DC1.VIN-_2 23.81,5.71 22.67,4.57 10.67,4.57 GND.TP | JP11.2 48.26,49.53 38.73,49.53 37.47,50.8 JP9.4 | U1.J3_22 76.2,57.78 76.2,59.88 75.75,60.33 74.11,60.33 73.66,59.88 73.66,57.68 U1.J3_21 | DC/DC2.VIN-_1 47.31,4.13 68.26,4.13 69.53,5.4 U2.4 | v29.21,58.42 28.89,58.74 24.13,58.74 23.18,57.78 U1.J3_1
  Bottom 0.305: TFT1.GND 72.07,73.66 C13.2 71.75,73.66 68.58,73.66 C12.2 68.26,73.66 66.99,72.39 66.99,70.17 67.31,69.85 v67.31,65.72 67.31,64.47 C16.1 | U4.GND 62.23,62.23 62.23,64.14 C17.1 62.23,64.45 61.28,64.45 58.42,67.31 52.39,67.31 R19.1 52.07,67.63 50.8,68.9 49.21,68.9 47.31,70.8 R14.1 46.99,70.8 46.35,70.8 45.09,69.53 39.05,69.53 38.1,68.58 38.1,64.14 | 19.37,94.3 21.27,94.3 22.54,95.57 32.38,95.57 U6.GND1 | 19.37,94.3 18.1,95.57 C19.2 17.78,95.89 17.78,99.06 C18.2 15.89,99.06 C7.2 | 11.75,64.14 13.65,64.14 C2.2 13.97,64.45 13.97,67.31 R11.1 | C3.2 21.91,64.14 21.91,62.55 22.86,61.59 U3.ADDR | 22.86,60.33 22.86,61.28 U3.ADDR | 22.86,60.33 22.86,57.78 U1.J3_1 | 11.75,64.14 11.75,61.28 12.7,60.33 22.86,60.33 | 11.75,64.14 C1.2 11.43,64.45 v11.43,65.72 | 38.42,64.14 39.05,64.14 C5.2 | 38.42,64.14 38.1,64.14 | 38.1,64.14 37.15,64.14 C14.1 36.83,64.45 35.88,64.45 34.61,65.72 26.99,65.72 | 38.42,64.14 40.64,66.36 41.27,66.36 41.59,66.04 42.55,66.04 44.13,64.45 C6.2 | R13.1 28.89,67.63 26.99,67.63 R12.1 26.99,67.31 26.99,65.72 | 27.94,64.14 28.89,64.14 C15.1 | 27.94,64.14 26.99,64.14 C4.2 | 27.94,64.14 30.48,61.59 U3.GND | 26.99,65.72 26.99,64.45 C4.2 | U3.ADDR 23.18,61.59 24.13,61.59 26.67,64.14 C4.2 | 19.37,94.3 19.37,91.12 9.84,81.6 9.84,66.04 v9.53,65.72 | J4.7 9.53,39.37 9.53,38.42 23.18,24.77 DC/DC1.VOUT-_2 | DC/DC2.VOUT-_1 45.72,23.81 45.72,17.14 C8.2 | DC/DC1.VOUT-_1 26.67,23.81 26.67,17.14 C9.2 | C10.2 22.23,37.47 25.4,37.47 C11.2 25.72,37.78 28.89,37.78 31.11,40.01 31.11,50.16 JP9.4 29.21,52.07 v29.21,58.42 | U2.4 69.53,5.71 69.53,15.56 65.09,20 U2.2 64.77,20.32 59.69,25.4 59.69,32.7 49.53,42.86 JP11.2
  Bottom 0.305: U1.J3_22 76.2,57.47 76.2,32.38 U1.J1_22 76.2,32.07
  Bottom 1.016: JP5.1 JP3.1 JP6.1 JP2.1 JP4.1 JP7.1 22.86,120.65 24.13,119.38 24.13,113.03 16.51,105.41 13.97,105.41 12.59,104.03 C7.2
  Bottom 1.524: DC/DC1.VIN-_2 DC/DC1.VIN-_1 | DC/DC1.VOUT-_2 DC/DC1.VOUT-_1 | DC/DC2.VOUT-_2 DC/DC2.VOUT-_1 | C8.2 46.1,6.61 DC/DC2.VIN-_1 DC/DC2.VIN-_2 39.5,2.54 29.21,2.54 26.42,5.33 DC/DC1.VIN-_1 | DC/DC1.VIN-_1 26.42,16.13 C9.2 | J1.2 26.42,9.51 DC/DC1.VIN-_1
  pour Bottom: -2.54,127 81.28,127 81.28,-3.81 -2.54,-3.81
GPIO1
  Bottom 0.305: JP10.1 36.83,47.31 30.8,53.34 30.8,57.47 U1.J3_4
GPIO2
  Bottom 0.305: JP10.2 39.37,46.35 33.34,52.39 33.34,57.47 U1.J3_5
GPIO3
  Top 0.305: JP8.1 41.91,39.37 41.91,31.75 42.55,31.11 52.39,31.11 53.34,32.07 U1.J1_13
GPIO4
  Bottom 0.305: JP8.2 30.8,35.88 30.8,32.38 U1.J1_4
IRQ_BREAK
  Top 0.305: JP11.8 62.87,52.7 40.64,52.7 35.88,57.47 U1.J3_6
LED  (via drill 0.35)
  Top 0.305: TFT-BL.TP 13.97,8.89 28.38,8.89 33.78,3.49 69.53,3.49 75.56,9.53 75.56,16.76 70.55,21.78 67.12,21.78 v66.74,22.16 | TFT1.LED 73.34,86.68 73.34,78.42 71.12,76.2 v71.12,66.67
  Bottom 0.305: v66.74,22.16 66.74,24.83 JP1.2 69.85,27.94 69.85,43.5 74.93,48.58 74.93,58.1 74.3,58.74 73.98,58.74 71.12,61.59 v71.12,66.67
LED_DIM
  Bottom 0.305: JP1.3 70.74,24.51 70.74,23.11 71.5,22.35 73.15,22.35 73.66,22.86 73.66,26.2 Q1.3
LED_PWM  (via drill 0.35)
  Top 0.305: v71.25,29.59 70.61,28.96 36.45,28.96 33.34,32.07 U1.J1_5
  Bottom 0.305: v71.25,29.59 71.8,29.04 Q1.1 73.34,27.75 72.31,26.72 R20.1
LIPO
  Top 0.305: LIPO.TP 17.14,17.14 25.08,17.14 25.53,17.59
  Top 1.524: J1.1 25.53,17.59 37.08,6.04 | 37.08,6.04 DC/DC1.VIN+_1 40.01,8.89 50.67,8.89 DC/DC2.VIN+_2 DC/DC2.VIN+_1 | DC/DC1.VIN+_2 34.62,6.04 37.08,6.04
MISO  (via drill 0.35)
  Top 0.305: v73.34,91.44 TFT1.MISO | v25.4,23.18 60.52,23.18 61.47,24.13 v65.41,24.13
  Bottom 0.305: v73.34,91.44 73.34,99.38 TFT1.T_DO 75.56,102.23 71.44,106.36 71.44,120.33 69.85,121.92 8.57,121.92 1.27,114.62 1.27,34.29 12.38,23.18 v25.4,23.18 | JP11.5 68.58,39.37 68.58,32.38 U1.J1_19 68.58,32.07 66.04,29.53 66.04,24.77 v65.41,24.13
MOSI  (via drill 0.35)
  Top 0.305: v72.39,97.47 73.98,99.06 TFT1.T_DIN | JP11.4 v54.61,46.99 | v71.75,80.01 71.75,78.74 71.12,78.11 63.5,70.48 v63.5,65.72
  Bottom 0.305: v72.39,97.47 72.39,87.63 75.56,84.45 TFT1.MOSI v71.75,80.01 | v54.61,46.99 63.5,38.1 63.5,32.38 U1.J1_17 | v63.5,65.72 63.5,62.55 62.87,61.91 62.87,60.01 64.77,58.1 64.77,57.15 62.23,54.61 56.52,54.61 54.61,52.7 JP11.4
N$3  (via drill 0.35)
  Top 0.305: v33.97,69.22 30.48,72.71 26.35,72.71 23.5,75.56 21.59,75.56 v21.27,75.25 | v13.65,82.87 13.65,92.77 12.13,94.3 5.91,94.3 4.32,92.71 4.32,70.04 2.22,67.94 2.22,47.69 7.68,42.23 9.21,42.23 J4.6
  Bottom 0.305: v33.97,69.22 33.97,67.63 R18.2 | v13.65,82.87 v21.27,75.25
N$4
  Bottom 0.305: R17.1 39.37,67.63 40.01,67.63 41.27,68.9 42.86,68.9 44.13,67.63 R16.2
N$5
  Bottom 0.305: R7.1 21.91,71.12 23.18,72.39 25.4,72.39 26.67,71.12 R6.2
N$6
  Bottom 0.305: R10.1 11.75,70.8 13.65,70.8 R9.2
N$10
  Bottom 0.305: R8.1 8.57,67.31 8.57,64.45 C1.1 8.89,64.14 8.89,62.87 10.16,61.59 U3.A3
N$11  (via drill 0.35)
  Top 0.305: v22.54,29.53 10.48,41.59 10.48,44.45 9.53,44.45 J4.5
  Bottom 0.305: v22.54,29.53 32.07,29.53 34.29,31.75 34.29,32.7 44.45,42.86 44.45,58.1 47.31,60.96 47.31,61.91 46.04,63.18 46.04,64.45 44.77,65.72 43.81,65.72 42.23,67.31 R17.2
N$13  (via drill 0.35)
  Top 0.305: v50.48,69.85 45.09,64.45 v25.72,64.45
  Bottom 0.305: U3.A0 18.1,61.28 20,63.18 20,64.45 21.27,65.72 22.54,65.72 23.81,64.45 C4.1 24.13,64.45 v25.72,64.45 | v50.48,69.85 49.53,70.8 R1.1
N$14
  Bottom 0.305: R16.1 47.31,67.63 49.21,67.63 R19.2 49.21,67.31 52.07,64.45 R15.2
N$15
  Bottom 0.305: R2.1 42.23,70.8 44.13,70.8 R14.2 44.45,71.12 45.72,72.39 49.85,72.39 51.12,71.12 52.07,71.12 R1.2
N$17  (via drill 0.35)
  Top 0.305: v21.27,69.22 v27.3,69.22
  Bottom 0.305: U3.A1 15.56,61.59 16.19,61.59 18.73,64.14 C3.1 19.05,64.45 20,65.41 20,67.94 v21.27,69.22 | v27.3,69.22 28.89,70.8 R3.1
N$18
  Bottom 0.305: R5.1 18.73,67.31 16.83,65.41 16.83,64.45 C2.1 16.51,64.14 13.97,61.59 13.02,61.59 U3.A2
N$19  (via drill 0.35)
  Top 0.305: v37.15,66.04 37.78,65.41 v40.96,65.41
  Bottom 0.305: U4.A1 46.04,61.59 45.09,62.55 43.81,62.55 42.23,64.14 C5.1 41.91,64.45 v40.96,65.41 | v37.15,66.04 37.15,67.31 R18.1
N$20
  Bottom 0.305: 48.9,64.14 49.21,64.14 R15.1 48.9,64.14 | 48.9,64.14 47.31,64.14 C6.1 | 48.9,64.14 48.9,61.59 U4.A0
N$22
  Bottom 0.305: 14.61,68.9 15.24,68.9 16.51,67.63 R11.2 | 14.61,68.9 13.02,68.9 11.75,67.63 R8.2 | 14.61,68.9 16.51,70.8 R9.1
N$23  (via drill 0.35)
  Top 0.305: v17.78,74.3 17.78,74.17 10.29,66.67 9.21,66.67 7.3,64.77 7.3,50.8 9.84,50.8 10.48,51.44 10.48,53.66 9.84,54.29 9.53,54.29 J4.1
  Bottom 0.305: v17.78,74.3 18.41,73.66 36.51,73.66 39.05,71.12 R2.2
N$24
  Bottom 0.305: 32.07,70.8 32.07,67.63 R13.2 | 32.07,70.8 33.97,70.8 R4.1 | 32.07,70.8 R3.2
N$25
  Bottom 0.305: R5.2 21.91,67.63 23.81,67.63 R12.2 24.13,67.63 24.13,70.8 R6.1
N$26  (via drill 0.35)
  Top 0.305: v10.48,62.87 11.43,61.91 11.43,49.53 9.53,49.53 J4.3
  Bottom 0.305: v10.48,62.87 10.48,71.75 11.11,72.39 17.14,72.39 17.46,72.07 17.78,72.07 18.73,71.12 R7.2
N$27  (via drill 0.35)
  Top 0.305: v8.57,69.22 7.62,68.26 6.03,68.26 5.4,67.63 5.4,49.21 7.62,46.99 J4.4
  Bottom 0.305: v8.57,69.22 8.57,70.8 R10.2
N$30  (via drill 0.35)
  Top 0.305: v17.78,73.03 17.78,70.99 11.18,64.39 8.85,64.39 7.94,63.25 7.94,52.07 9.21,52.07 J4.2
  Bottom 0.305: v17.78,73.03 33.97,73.03 35.88,71.12 36.83,71.12 R4.2
RESET
  Top 0.305: JP11.7 63.5,49.53 65.41,49.53 66.36,50.48 68.26,50.48 69.22,49.53 69.22,48.26 58.74,37.78 58.74,32.38 U1.J1_15
  Bottom 0.305: TFT1.RST 71.44,78.74 66.36,73.66 66.36,59.05 67.31,58.1 67.31,55.88 JP11.7
S1  (via drill 0.35)
  Top 0.305: v8.89,96.52 JP5.3 | v8.89,93.03 8.89,70.17 6.67,70.17 v5.08,68.58 | v8.89,27.94 8.89,14.92 11.43,12.38 12.06,11.75 v29.53,11.75
  Bottom 0.305: v8.89,93.03 v8.89,96.52 | v5.08,68.58 5.08,33.97 8.89,30.16 v8.89,27.94 | v29.53,11.75 32.38,11.75 38.42,17.78 38.42,29.53 35.88,32.07 U1.J1_6
S2  (via drill 0.35)
  Top 0.305: JP3.3 12.7,114.3 14.29,114.3 15.24,115.25 15.24,118.62 16,119.38 21.91,119.38 25.08,116.2 25.08,99.38 33.02,99.38 33.66,98.74 33.66,94.3 25.08,94.3 20.32,89.53 20.32,63.88 21.65,62.55 26.04,62.55 26.67,61.91 v26.67,60.96 | v26.67,46.35 40.64,32.38 U1.J1_8
  Bottom 0.305: v26.67,46.35 v26.67,60.96
S3  (via drill 0.35)
  Top 0.305: JP6.3 12.7,116.84 8.57,116.84 5.08,113.35 v5.08,99.69 | v7.94,29.84 8.89,28.89 9.21,28.89 9.53,28.57 14.29,28.57 14.61,28.89 20.95,28.89 23.81,26.04 39.05,26.04 v39.37,25.72
  Bottom 0.305: v5.08,99.69 5.08,70.48 4.13,69.53 4.13,33.66 v7.94,29.84 | v39.37,25.72 39.37,28.26 43.18,32.07 U1.J1_9
S4  (via drill 0.35)
  Top 0.305: JP2.3 17.78,116.84 19.37,116.84 20.32,115.89 20.32,93.66 16.83,90.17 v16.83,85.72 | v27.94,74.61 48.9,74.61 v57.15,66.36
  Bottom 0.305: v27.94,74.61 v16.83,85.72 | v57.15,66.36 52.39,61.59 52.39,60.96 49.53,58.1 49.53,55.56 45.72,51.75 45.72,32.38 U1.J1_10
S5  (via drill 0.35)
  Top 0.305: JP4.3 9.84,106.36 9.84,95.57 4.76,95.57 1.27,92.08 1.27,43.81 14.29,30.8 20,30.8 24.13,26.67 v42.86,26.67
  Bottom 0.305: v42.86,26.67 48.26,32.07 U1.J1_11
S6  (via drill 0.35)
  Top 0.305: JP7.3 21.59,93.98 17.78,90.17 v17.78,86.04
  Bottom 0.305: v17.78,86.04 29.53,74.3 56.52,74.3 65.72,65.09 65.72,58.1 66.04,57.78 U1.J3_18
SCK  (via drill 0.35)
  Top 0.305: TFT1.T_CLK 74.61,93.98 72.52,91.89 72.52,78.55 69.85,75.88 v69.85,62.55 | v66.04,48.9 63.18,46.04 54.29,46.04 52.07,48.26 JP11.3
  Bottom 0.305: TFT1.SCK 75.56,87 74.3,88.27 74.3,92.71 TFT1.T_CLK | JP11.3 66.04,36.83 66.04,32.38 U1.J1_18 | v69.85,62.55 69.85,57.15 66.04,53.34 v66.04,48.9
SCL  (via drill 0.35)
  Top 0.305: U4.SCL 58.74,61.59 57.78,62.55 29.21,62.55 28.26,61.59 U3.SCL 27.94,61.59 26.35,63.18 25.34,63.18 24.77,63.75 24.77,66.36 25.4,66.99 28.26,66.99 28.26,69.53 v23.18,74.61 | JP9.2 26.67,49.53 v37.47,49.53
  Bottom 0.305: U3.SCL 28.26,61.28 29.53,61.28 32.07,58.74 42.23,58.74 43.18,57.78 U1.J3_9 43.18,57.47 37.47,51.75 v37.47,49.53 | v23.18,74.61 15.56,82.23 15.56,86.36 22.86,93.66 32.38,93.66 33.66,94.93 33.66,98.74 32.7,99.69 32.7,100.65 U6.SCL
SDA  (via drill 0.35)
  Top 0.305: v60.01,62.23 48.64,73.6 27.11,73.6 25.08,75.63 25.08,93.34 25.4,93.66 34.29,93.66 34.29,101.6 32.7,103.19 U6.SDA | JP9.1 22.86,53.34 24.77,55.24 32.38,55.24 34.29,57.15 34.29,58.17 34.86,58.74 62.55,58.74 63.5,57.78 U1.J3_17
  Bottom 0.305: JP9.1 24.13,52.07 24.13,58.1 25.4,59.37 25.4,61.28 U3.SDA | 60.01,59.05 60.33,58.74 62.55,58.74 63.5,57.78 U1.J3_17 | 60.01,59.05 57.78,61.28 56.52,61.28 U4.SDA | 60.01,59.05 v60.01,62.23
T_CS  (via drill 0.35)
  Top 0.305: U1.J1_20 72.26,31.13 72.26,25.4 69.72,22.86 61.91,22.86 61.28,22.23 22.86,22.23 v20.95,24.13 | v6.35,59.37 6.48,59.5 6.48,65.85 15.88,75.25 v15.88,103.19 | v25.08,120.02 25.4,120.33 71.44,120.33 71.44,97.22 72.14,96.52 TFT1.T_CS
  Bottom 0.305: v20.95,24.13 14.61,24.13 12.06,26.67 12.06,34.92 6.35,40.64 v6.35,59.37 | v15.88,103.19 25.08,112.39 v25.08,120.02
T_IRQ  (via drill 0.35)
  Top 0.305: v21.91,48.58 38.1,32.38 U1.J1_7 | v7.62,96.52 5.4,98.74 4.76,98.74 4.13,99.38 4.13,117.47 6.99,120.33 8.57,121.92 70.8,121.92 75.56,117.16 TFT1.T_IRQ
  Bottom 0.305: v21.91,48.58 21.91,49.85 21.27,50.48 21.27,53.66 15.24,59.69 10.79,59.69 7.62,62.87 v7.62,96.52
(copper drawn outside any net)
  shapes: Bottom area x1

### Text on the board
SilkscreenTop: GND | RC TOOLBOX | 5V | Sig | MHB Electronics | © 2026 - Chiefenne | 1 | 2 | 3 | 4 | 5 | 6 | ESP32-S3 DevkitC-1 | 5V | 3.3V | TFT BL Jp. | 3.3V | PWM | TFT BL | Test Points
SilkscreenBottom: I2C (3.3V) | SDA | SCL | VCC | GND | GPIO1 | GPIO2 | VCC | GND | SCK | MOSI | MISO | CS | RST | IRQ | GPIO4 | GPIO3